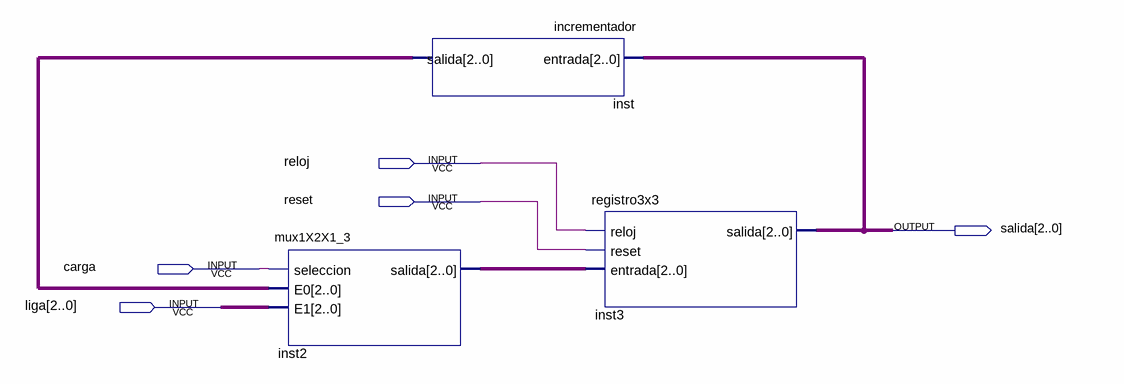
[diagram p0: schematic sheet]
// Quartus schematic contador.bdf as structural Verilog: 3 symbols, 5 pins
module contador (
  input  reloj,
  input  reset,
  input  carga,
  input  [2:0] liga,
  output [2:0] salida
);

  wire [2:0] inst2_salida, inst_salida;

  mux1X2X1_3 inst2 (.seleccion(carga), .E0(inst_salida), .E1(liga), .salida(inst2_salida));
  incrementador inst (.entrada(salida), .salida(inst_salida));
  registro3x3 inst3 (.reloj(reloj), .reset(reset), .entrada(inst2_salida), .salida(salida));
endmodule
